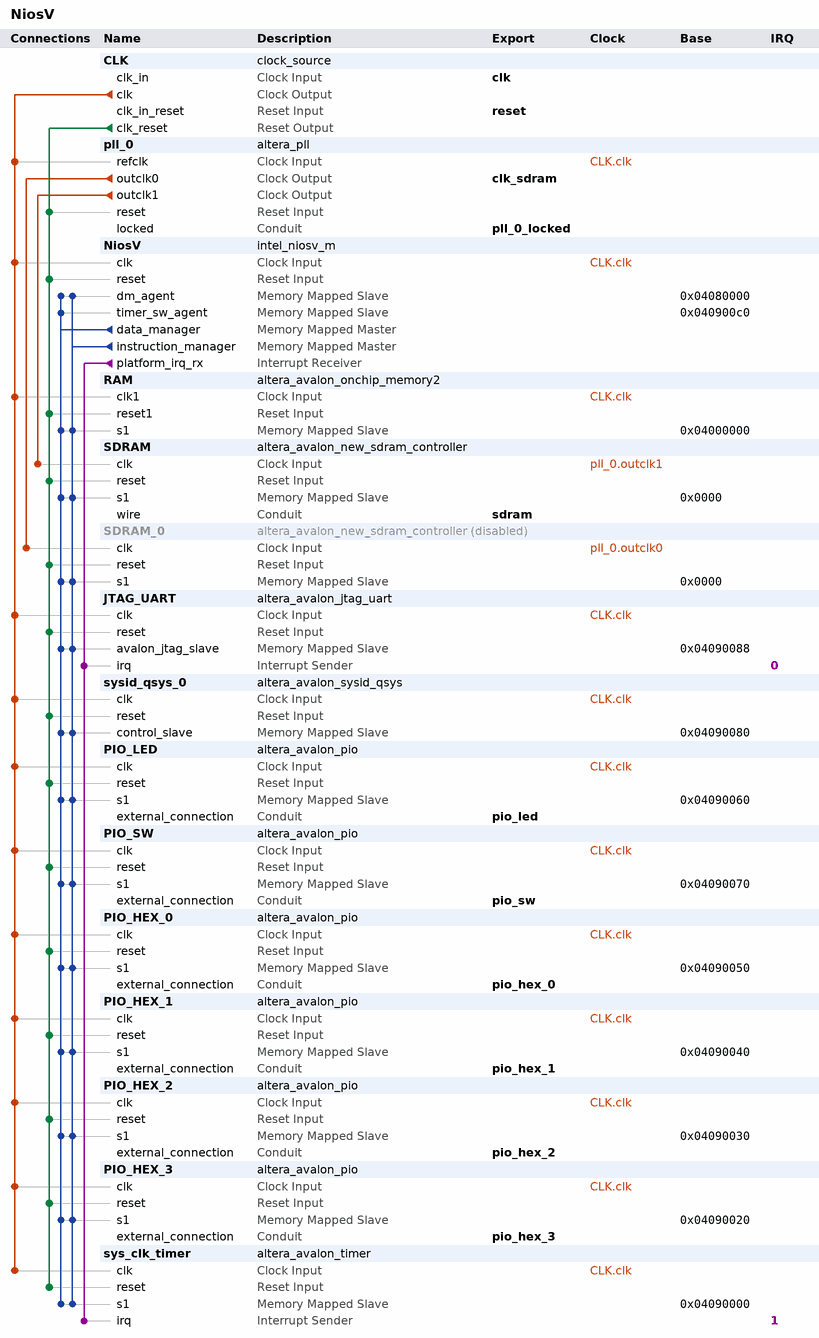
[diagram p0: system contents]
# Platform Designer (Qsys) system NiosV, Cyclone V 5CSXFC6D6F31C6
# Parameters at their usual value, and those the tool derives, are not listed.
package require -exact qsys 24.1
create_system NiosV
set_project_property DEVICE_FAMILY {Cyclone V}
set_project_property DEVICE 5CSXFC6D6F31C6

add_instance CLK clock_source 24.1
set_instance_parameter_value CLK clockFrequency 50000000

add_instance pll_0 altera_pll 24.1
set_instance_parameter_value pll_0 gui_device_speed_grade 1
set_instance_parameter_value pll_0 gui_number_of_clocks 2
set_instance_parameter_value pll_0 gui_operation_mode normal
set_instance_parameter_value pll_0 gui_output_clock_frequency0 100.0
set_instance_parameter_value pll_0 gui_output_clock_frequency1 100.0
set_instance_parameter_value pll_0 gui_phase_shift0 -3800
set_instance_parameter_value pll_0 gui_pll_mode {Integer-N PLL}
set_instance_parameter_value pll_0 gui_reference_clock_frequency 50.0
set_instance_parameter_value pll_0 gui_use_locked true

add_instance NiosV intel_niosv_m 26.0.0
set_instance_parameter_value NiosV enableAvalonInterface false
set_instance_parameter_value NiosV enableDebugReset false
set_instance_parameter_value NiosV enableECCLite false
set_instance_parameter_value NiosV hartId 0
set_instance_parameter_value NiosV interruptMode 0
set_instance_parameter_value NiosV pipelineArch true
set_instance_parameter_value NiosV resetSlave SDRAM.s1

add_instance RAM altera_avalon_onchip_memory2 24.1
set_instance_parameter_value RAM dataWidth 32
set_instance_parameter_value RAM dualPort false
set_instance_parameter_value RAM initMemContent true
set_instance_parameter_value RAM initializationFileName onchip_mem.hex
set_instance_parameter_value RAM memorySize 491520

add_instance SDRAM altera_avalon_new_sdram_controller 18.1
set_instance_parameter_value SDRAM TAC 5.5
set_instance_parameter_value SDRAM TRCD 20.0
set_instance_parameter_value SDRAM TRP 20.0
set_instance_parameter_value SDRAM casLatency 3
set_instance_parameter_value SDRAM columnWidth 10
set_instance_parameter_value SDRAM dataWidth 16
set_instance_parameter_value SDRAM generateSimulationModel false
set_instance_parameter_value SDRAM model single_Micron_MT48LC4M32B2_7_chip
set_instance_parameter_value SDRAM numberOfBanks 4
set_instance_parameter_value SDRAM numberOfChipSelects 1
set_instance_parameter_value SDRAM powerUpDelay 100.0
set_instance_parameter_value SDRAM refreshPeriod 15.625
set_instance_parameter_value SDRAM rowWidth 13

add_instance SDRAM_0 altera_avalon_new_sdram_controller 18.1
set_instance_property SDRAM_0 ENABLED false
set_instance_parameter_value SDRAM_0 TAC 5.5
set_instance_parameter_value SDRAM_0 TRCD 20.0
set_instance_parameter_value SDRAM_0 TRP 20.0
set_instance_parameter_value SDRAM_0 casLatency 3
set_instance_parameter_value SDRAM_0 columnWidth 8
set_instance_parameter_value SDRAM_0 dataWidth 16
set_instance_parameter_value SDRAM_0 generateSimulationModel false
set_instance_parameter_value SDRAM_0 model single_Micron_MT48LC4M32B2_7_chip
set_instance_parameter_value SDRAM_0 numberOfBanks 4
set_instance_parameter_value SDRAM_0 numberOfChipSelects 1
set_instance_parameter_value SDRAM_0 powerUpDelay 100.0
set_instance_parameter_value SDRAM_0 refreshPeriod 15.625
set_instance_parameter_value SDRAM_0 rowWidth 12

add_instance JTAG_UART altera_avalon_jtag_uart 24.1
set_instance_parameter_value JTAG_UART simInteractiveOptions NO_INTERACTIVE_WINDOWS

add_instance sysid_qsys_0 altera_avalon_sysid_qsys 24.1
set_instance_parameter_value sysid_qsys_0 id 0

add_instance PIO_LED altera_avalon_pio 24.1
set_instance_parameter_value PIO_LED direction Output
set_instance_parameter_value PIO_LED width 8

add_instance PIO_SW altera_avalon_pio 24.1
set_instance_parameter_value PIO_SW direction Input
set_instance_parameter_value PIO_SW width 8

add_instance PIO_HEX_0 altera_avalon_pio 24.1
set_instance_parameter_value PIO_HEX_0 direction Output
set_instance_parameter_value PIO_HEX_0 width 8

add_instance PIO_HEX_1 altera_avalon_pio 24.1
set_instance_parameter_value PIO_HEX_1 direction Output
set_instance_parameter_value PIO_HEX_1 width 8

add_instance PIO_HEX_2 altera_avalon_pio 24.1
set_instance_parameter_value PIO_HEX_2 direction Output
set_instance_parameter_value PIO_HEX_2 width 8

add_instance PIO_HEX_3 altera_avalon_pio 24.1
set_instance_parameter_value PIO_HEX_3 direction Output
set_instance_parameter_value PIO_HEX_3 width 8

add_instance sys_clk_timer altera_avalon_timer 24.1
set_instance_parameter_value sys_clk_timer period 1
set_instance_parameter_value sys_clk_timer periodUnits MSEC

# connections
add_connection CLK.clk JTAG_UART.clk clock
add_connection CLK.clk NiosV.clk clock
add_connection CLK.clk PIO_HEX_0.clk clock
add_connection CLK.clk PIO_HEX_1.clk clock
add_connection CLK.clk PIO_HEX_2.clk clock
add_connection CLK.clk PIO_HEX_3.clk clock
add_connection CLK.clk PIO_LED.clk clock
add_connection CLK.clk PIO_SW.clk clock
add_connection CLK.clk pll_0.refclk clock
add_connection CLK.clk RAM.clk1 clock
add_connection CLK.clk sys_clk_timer.clk clock
add_connection CLK.clk sysid_qsys_0.clk clock
add_connection pll_0.outclk0 SDRAM_0.clk clock
add_connection pll_0.outclk1 SDRAM.clk clock
add_connection CLK.clk_reset JTAG_UART.reset reset
add_connection CLK.clk_reset NiosV.reset reset
add_connection CLK.clk_reset PIO_HEX_0.reset reset
add_connection CLK.clk_reset PIO_HEX_1.reset reset
add_connection CLK.clk_reset PIO_HEX_2.reset reset
add_connection CLK.clk_reset PIO_HEX_3.reset reset
add_connection CLK.clk_reset PIO_LED.reset reset
add_connection CLK.clk_reset PIO_SW.reset reset
add_connection CLK.clk_reset pll_0.reset reset
add_connection CLK.clk_reset RAM.reset1 reset
add_connection CLK.clk_reset SDRAM.reset reset
add_connection CLK.clk_reset SDRAM_0.reset reset
add_connection CLK.clk_reset sys_clk_timer.reset reset
add_connection CLK.clk_reset sysid_qsys_0.reset reset
add_connection NiosV.data_manager JTAG_UART.avalon_jtag_slave avalon
set_connection_parameter_value NiosV.data_manager/JTAG_UART.avalon_jtag_slave baseAddress 0x04090088
add_connection NiosV.data_manager NiosV.dm_agent avalon
set_connection_parameter_value NiosV.data_manager/NiosV.dm_agent baseAddress 0x04080000
add_connection NiosV.data_manager NiosV.timer_sw_agent avalon
set_connection_parameter_value NiosV.data_manager/NiosV.timer_sw_agent baseAddress 0x040900c0
add_connection NiosV.data_manager PIO_HEX_0.s1 avalon
set_connection_parameter_value NiosV.data_manager/PIO_HEX_0.s1 baseAddress 0x04090050
add_connection NiosV.data_manager PIO_HEX_1.s1 avalon
set_connection_parameter_value NiosV.data_manager/PIO_HEX_1.s1 baseAddress 0x04090040
add_connection NiosV.data_manager PIO_HEX_2.s1 avalon
set_connection_parameter_value NiosV.data_manager/PIO_HEX_2.s1 baseAddress 0x04090030
add_connection NiosV.data_manager PIO_HEX_3.s1 avalon
set_connection_parameter_value NiosV.data_manager/PIO_HEX_3.s1 baseAddress 0x04090020
add_connection NiosV.data_manager PIO_LED.s1 avalon
set_connection_parameter_value NiosV.data_manager/PIO_LED.s1 baseAddress 0x04090060
add_connection NiosV.data_manager PIO_SW.s1 avalon
set_connection_parameter_value NiosV.data_manager/PIO_SW.s1 baseAddress 0x04090070
add_connection NiosV.data_manager RAM.s1 avalon
set_connection_parameter_value NiosV.data_manager/RAM.s1 baseAddress 0x04000000
add_connection NiosV.data_manager SDRAM.s1 avalon
set_connection_parameter_value NiosV.data_manager/SDRAM.s1 baseAddress 0x0000
add_connection NiosV.data_manager SDRAM_0.s1 avalon
set_connection_parameter_value NiosV.data_manager/SDRAM_0.s1 baseAddress 0x0000
add_connection NiosV.data_manager sys_clk_timer.s1 avalon
set_connection_parameter_value NiosV.data_manager/sys_clk_timer.s1 baseAddress 0x04090000
add_connection NiosV.data_manager sysid_qsys_0.control_slave avalon
set_connection_parameter_value NiosV.data_manager/sysid_qsys_0.control_slave baseAddress 0x04090080
add_connection NiosV.instruction_manager JTAG_UART.avalon_jtag_slave avalon
set_connection_parameter_value NiosV.instruction_manager/JTAG_UART.avalon_jtag_slave baseAddress 0x04090088
add_connection NiosV.instruction_manager NiosV.dm_agent avalon
set_connection_parameter_value NiosV.instruction_manager/NiosV.dm_agent baseAddress 0x04080000
add_connection NiosV.instruction_manager PIO_HEX_0.s1 avalon
set_connection_parameter_value NiosV.instruction_manager/PIO_HEX_0.s1 baseAddress 0x04090050
add_connection NiosV.instruction_manager PIO_HEX_1.s1 avalon
set_connection_parameter_value NiosV.instruction_manager/PIO_HEX_1.s1 baseAddress 0x04090040
add_connection NiosV.instruction_manager PIO_HEX_2.s1 avalon
set_connection_parameter_value NiosV.instruction_manager/PIO_HEX_2.s1 baseAddress 0x04090030
add_connection NiosV.instruction_manager PIO_HEX_3.s1 avalon
set_connection_parameter_value NiosV.instruction_manager/PIO_HEX_3.s1 baseAddress 0x04090020
add_connection NiosV.instruction_manager PIO_LED.s1 avalon
set_connection_parameter_value NiosV.instruction_manager/PIO_LED.s1 baseAddress 0x04090060
add_connection NiosV.instruction_manager PIO_SW.s1 avalon
set_connection_parameter_value NiosV.instruction_manager/PIO_SW.s1 baseAddress 0x04090070
add_connection NiosV.instruction_manager RAM.s1 avalon
set_connection_parameter_value NiosV.instruction_manager/RAM.s1 baseAddress 0x04000000
add_connection NiosV.instruction_manager SDRAM.s1 avalon
set_connection_parameter_value NiosV.instruction_manager/SDRAM.s1 baseAddress 0x0000
add_connection NiosV.instruction_manager SDRAM_0.s1 avalon
set_connection_parameter_value NiosV.instruction_manager/SDRAM_0.s1 baseAddress 0x0000
add_connection NiosV.instruction_manager sys_clk_timer.s1 avalon
set_connection_parameter_value NiosV.instruction_manager/sys_clk_timer.s1 baseAddress 0x04090000
add_connection NiosV.instruction_manager sysid_qsys_0.control_slave avalon
set_connection_parameter_value NiosV.instruction_manager/sysid_qsys_0.control_slave baseAddress 0x04090080
add_connection NiosV.platform_irq_rx JTAG_UART.irq interrupt
set_connection_parameter_value NiosV.platform_irq_rx/JTAG_UART.irq irqNumber 0
add_connection NiosV.platform_irq_rx sys_clk_timer.irq interrupt
set_connection_parameter_value NiosV.platform_irq_rx/sys_clk_timer.irq irqNumber 1

# exported interfaces
add_interface clk clock sink
set_interface_property clk EXPORT_OF CLK.clk_in
add_interface clk_sdram clock source
set_interface_property clk_sdram EXPORT_OF pll_0.outclk0
add_interface pio_hex_0 conduit end
set_interface_property pio_hex_0 EXPORT_OF PIO_HEX_0.external_connection
add_interface pio_hex_1 conduit end
set_interface_property pio_hex_1 EXPORT_OF PIO_HEX_1.external_connection
add_interface pio_hex_2 conduit end
set_interface_property pio_hex_2 EXPORT_OF PIO_HEX_2.external_connection
add_interface pio_hex_3 conduit end
set_interface_property pio_hex_3 EXPORT_OF PIO_HEX_3.external_connection
add_interface pio_led conduit end
set_interface_property pio_led EXPORT_OF PIO_LED.external_connection
add_interface pio_sw conduit end
set_interface_property pio_sw EXPORT_OF PIO_SW.external_connection
add_interface pll_0_locked conduit end
set_interface_property pll_0_locked EXPORT_OF pll_0.locked
add_interface reset reset sink
set_interface_property reset EXPORT_OF CLK.clk_in_reset
add_interface sdram conduit end
set_interface_property sdram EXPORT_OF SDRAM.wire

set_interconnect_requirement {$system} qsys_mm.clockCrossingAdapter HANDSHAKE
set_interconnect_requirement {$system} qsys_mm.enableEccProtection FALSE
set_interconnect_requirement {$system} qsys_mm.insertDefaultSlave FALSE
set_interconnect_requirement {$system} qsys_mm.maxAdditionalLatency 1

save_system NiosV.qsys
